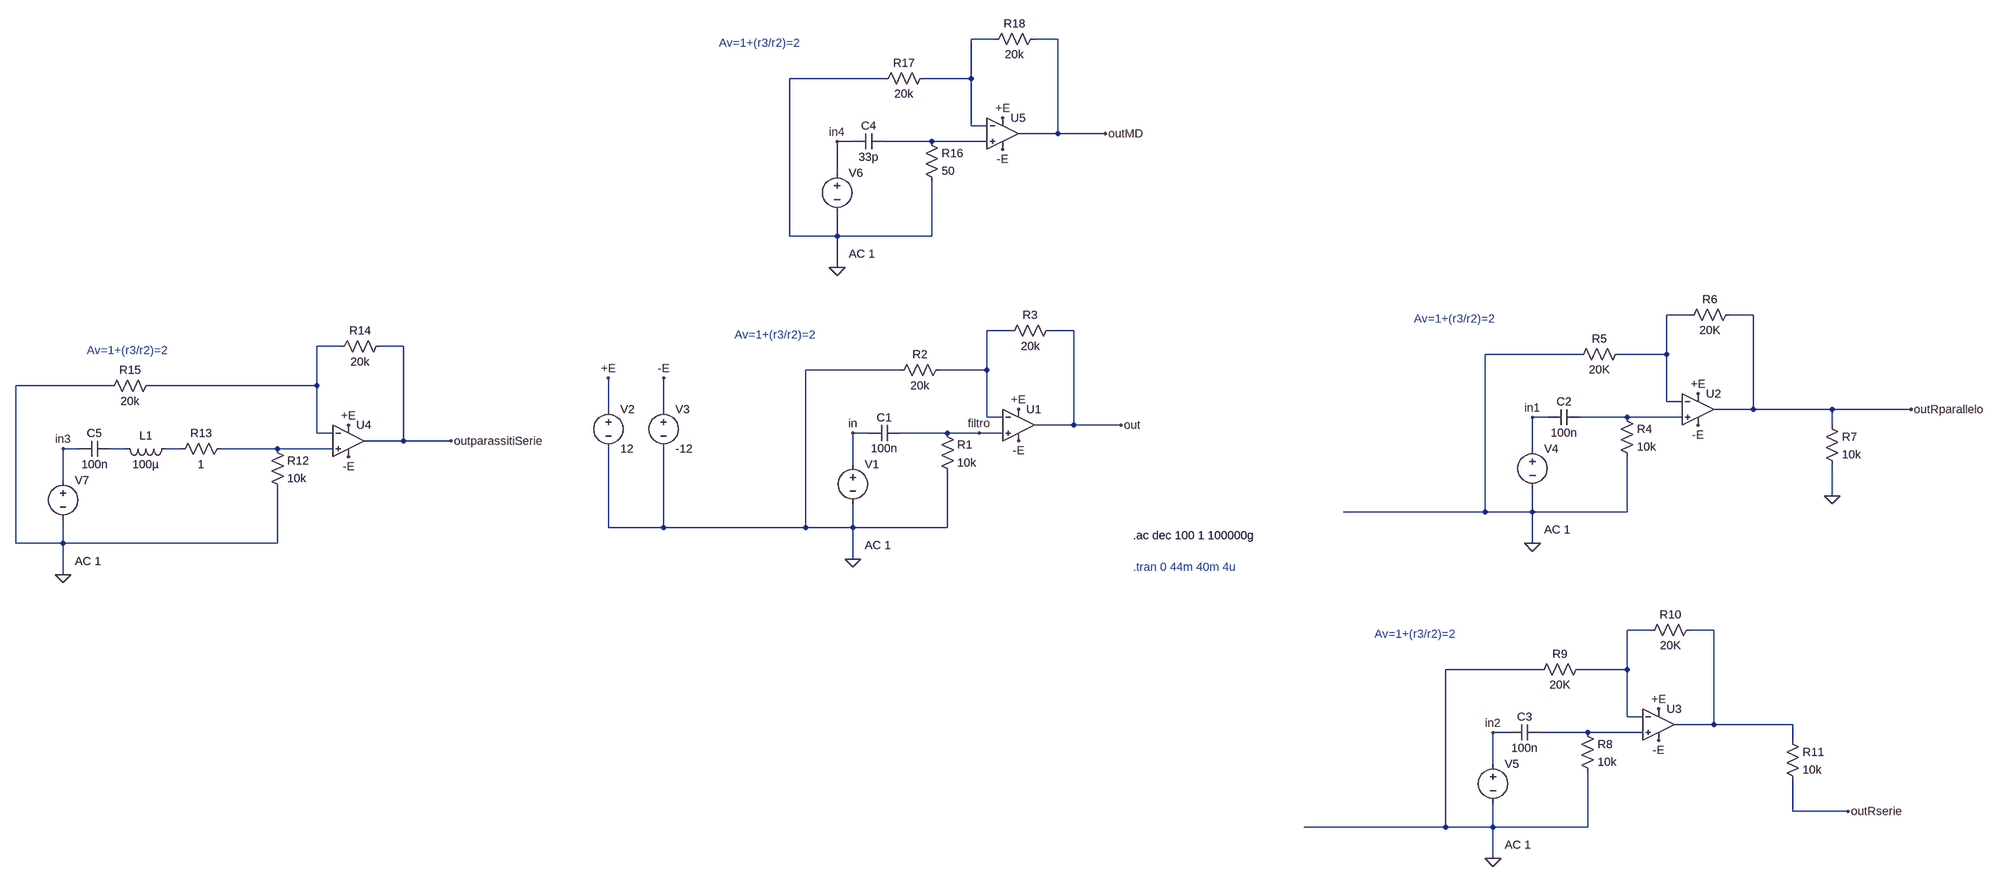
[diagram p0: schematic filto-passa-alto-rc-attivo.asc]
filto-passa-alto-rc-attivo.asc, the LTspice schematic file:
Version 4.1
SHEET 1 2316 1028
WIRE 192 -656 144 -656
WIRE 320 -656 272 -656
WIRE -32 -576 -224 -576
WIRE 144 -576 144 -656
WIRE 144 -576 48 -576
WIRE 144 -480 144 -576
WIRE 176 -480 144 -480
WIRE 320 -464 320 -656
WIRE 320 -464 240 -464
WIRE 416 -464 320 -464
WIRE -96 -448 -128 -448
WIRE 64 -448 -32 -448
WIRE 176 -448 64 -448
WIRE -128 -384 -128 -448
WIRE -224 -256 -224 -576
WIRE -128 -256 -128 -304
WIRE -128 -256 -224 -256
WIRE 64 -256 64 -368
WIRE 64 -256 -128 -256
WIRE -128 -192 -128 -256
WIRE 1696 -96 1648 -96
WIRE 1824 -96 1776 -96
WIRE 224 -64 176 -64
WIRE 352 -64 304 -64
WIRE -1312 -32 -1360 -32
WIRE -1184 -32 -1232 -32
WIRE 1472 -16 1280 -16
WIRE 1648 -16 1648 -96
WIRE 1648 -16 1552 -16
WIRE 0 16 -192 16
WIRE 176 16 176 -64
WIRE 176 16 80 16
WIRE -1824 48 -2016 48
WIRE -1360 48 -1360 -32
WIRE -1360 48 -1744 48
WIRE 1648 80 1648 -16
WIRE 1680 80 1648 80
WIRE -592 96 -592 32
WIRE -480 96 -480 32
WIRE 1824 96 1824 -96
WIRE 1824 96 1744 96
WIRE 1984 96 1824 96
WIRE 2144 96 1984 96
WIRE 176 112 176 16
WIRE 208 112 176 112
WIRE 1408 112 1376 112
WIRE 1568 112 1472 112
WIRE 1680 112 1568 112
WIRE 352 128 352 -64
WIRE 352 128 272 128
WIRE 448 128 352 128
WIRE 1984 128 1984 96
WIRE -1360 144 -1360 48
WIRE -1328 144 -1360 144
WIRE -64 144 -96 144
WIRE 96 144 0 144
WIRE 160 144 96 144
WIRE 208 144 160 144
WIRE -1184 160 -1184 -32
WIRE -1184 160 -1264 160
WIRE -1088 160 -1184 160
WIRE -1888 176 -1920 176
WIRE -1792 176 -1824 176
WIRE -1680 176 -1712 176
WIRE -1440 176 -1600 176
WIRE -1328 176 -1440 176
WIRE 1376 176 1376 112
WIRE -96 208 -96 144
WIRE -1920 240 -1920 176
WIRE 1984 272 1984 208
WIRE 1280 304 1280 -16
WIRE 1280 304 992 304
WIRE 1376 304 1376 256
WIRE 1376 304 1280 304
WIRE 1568 304 1568 192
WIRE 1568 304 1376 304
WIRE -592 336 -592 176
WIRE -480 336 -480 176
WIRE -480 336 -592 336
WIRE -192 336 -192 16
WIRE -192 336 -480 336
WIRE -96 336 -96 288
WIRE -96 336 -192 336
WIRE 96 336 96 224
WIRE 96 336 -96 336
WIRE -2016 368 -2016 48
WIRE -1920 368 -1920 320
WIRE -1920 368 -2016 368
WIRE -1440 368 -1440 256
WIRE -1440 368 -1920 368
WIRE 1376 368 1376 304
WIRE -96 400 -96 336
WIRE -1920 432 -1920 368
WIRE 1616 544 1568 544
WIRE 1744 544 1696 544
WIRE 1392 624 1200 624
WIRE 1568 624 1568 544
WIRE 1568 624 1472 624
WIRE 1568 720 1568 624
WIRE 1600 720 1568 720
WIRE 1744 736 1744 544
WIRE 1744 736 1664 736
WIRE 1904 736 1744 736
WIRE 1328 752 1296 752
WIRE 1488 752 1392 752
WIRE 1600 752 1488 752
WIRE 1904 768 1904 736
WIRE 1296 816 1296 752
WIRE 1904 912 1904 848
WIRE 2016 912 1904 912
WIRE 1200 944 1200 624
WIRE 1200 944 912 944
WIRE 1296 944 1296 896
WIRE 1296 944 1200 944
WIRE 1488 944 1488 832
WIRE 1488 944 1296 944
WIRE 1296 1008 1296 944
FLAG -96 400 0
FLAG 448 128 out
FLAG -96 144 in
FLAG -592 32 +E
FLAG -480 32 -E
FLAG 240 160 -E
FLAG 240 96 +E
FLAG 1376 368 0
FLAG 1376 112 in1
FLAG 1712 128 -E
FLAG 1712 64 +E
FLAG 1984 272 0
FLAG 2144 96 outRparallelo
FLAG 1296 1008 0
FLAG 1296 752 in2
FLAG 1632 768 -E
FLAG 1632 704 +E
FLAG 2016 912 outRserie
FLAG 160 144 filtro
FLAG -1088 160 outparassitiSerie
FLAG -1296 192 -E
FLAG -1296 128 +E
FLAG -1920 432 0
FLAG -1920 176 in3
FLAG -128 -192 0
FLAG 416 -464 outMD
FLAG -128 -448 in4
FLAG 208 -432 -E
FLAG 208 -496 +E
SYMBOL cap 0 128 R90
WINDOW 0 0 32 VBottom 2
WINDOW 3 32 32 VTop 2
SYMATTR InstName C1
SYMATTR Value 100n
SYMATTR SpiceLine Rser=1 Lser=100u
SYMBOL res 80 128 R0
SYMATTR InstName R1
SYMATTR Value 10k
SYMBOL OpAmps\\UniversalOpAmp2 240 128 R0
SYMATTR InstName U1
SYMATTR Value2 Avol=1e12 GBW=1e15 Slew=1e15
SYMATTR SpiceLine Ilimit=1e9 Rail=0 Vos=0
SYMATTR SpiceLine2 En=0 Enk=0 In=0 Ink=0 Rin=1e12
SYMBOL res 96 0 R90
WINDOW 0 0 56 VBottom 2
WINDOW 3 32 56 VTop 2
SYMATTR InstName R2
SYMATTR Value 20k
SYMBOL res 320 -80 R90
WINDOW 0 0 56 VBottom 2
WINDOW 3 32 56 VTop 2
SYMATTR InstName R3
SYMATTR Value 20k
SYMBOL voltage -96 192 R0
WINDOW 3 24 44 Left 2
WINDOW 123 24 180 Left 2
WINDOW 39 0 0 Left 0
SYMATTR Value ""
SYMATTR Value2 AC 1
SYMATTR InstName V1
SYMBOL voltage -592 80 R0
WINDOW 123 0 0 Left 0
WINDOW 39 0 0 Left 0
SYMATTR InstName V2
SYMATTR Value 12
SYMBOL voltage -480 80 R0
WINDOW 123 0 0 Left 0
WINDOW 39 0 0 Left 0
SYMATTR InstName V3
SYMATTR Value -12
SYMBOL cap 1472 96 R90
WINDOW 0 0 32 VBottom 2
WINDOW 3 32 32 VTop 2
SYMATTR InstName C2
SYMATTR Value 100n
SYMBOL res 1552 96 R0
SYMATTR InstName R4
SYMATTR Value 10k
SYMBOL OpAmps\\UniversalOpAmp2 1712 96 R0
SYMATTR InstName U2
SYMBOL res 1568 -32 R90
WINDOW 0 0 56 VBottom 2
WINDOW 3 32 56 VTop 2
SYMATTR InstName R5
SYMATTR Value 20K
SYMBOL res 1792 -112 R90
WINDOW 0 0 56 VBottom 2
WINDOW 3 32 56 VTop 2
SYMATTR InstName R6
SYMATTR Value 20K
SYMBOL voltage 1376 160 R0
WINDOW 3 24 152 Left 2
WINDOW 123 24 180 Left 2
WINDOW 39 0 0 Left 0
SYMATTR Value ""
SYMATTR Value2 AC 1
SYMATTR InstName V4
SYMBOL res 1968 112 R0
SYMATTR InstName R7
SYMATTR Value 10k
SYMBOL cap 1392 736 R90
WINDOW 0 0 32 VBottom 2
WINDOW 3 32 32 VTop 2
SYMATTR InstName C3
SYMATTR Value 100n
SYMBOL res 1472 736 R0
SYMATTR InstName R8
SYMATTR Value 10k
SYMBOL OpAmps\\UniversalOpAmp2 1632 736 R0
SYMATTR InstName U3
SYMBOL res 1488 608 R90
WINDOW 0 0 56 VBottom 2
WINDOW 3 32 56 VTop 2
SYMATTR InstName R9
SYMATTR Value 20K
SYMBOL res 1712 528 R90
WINDOW 0 0 56 VBottom 2
WINDOW 3 32 56 VTop 2
SYMATTR InstName R10
SYMATTR Value 20K
SYMBOL voltage 1296 800 R0
WINDOW 3 24 152 Left 2
WINDOW 123 24 180 Left 2
WINDOW 39 0 0 Left 0
SYMATTR Value ""
SYMATTR Value2 AC 1
SYMATTR InstName V5
SYMBOL res 1888 752 R0
SYMATTR InstName R11
SYMATTR Value 10k
SYMBOL res -1456 160 R0
SYMATTR InstName R12
SYMATTR Value 10k
SYMBOL OpAmps\\UniversalOpAmp2 -1296 160 R0
SYMATTR InstName U4
SYMATTR Value2 Avol=1e12 GBW=1e15 Slew=1e15
SYMATTR SpiceLine Ilimit=1e9 Rail=0 Vos=0
SYMATTR SpiceLine2 En=0 Enk=0 In=0 Ink=0 Rin=1e12
SYMBOL res -1216 -48 R90
WINDOW 0 0 56 VBottom 2
WINDOW 3 32 56 VTop 2
SYMATTR InstName R14
SYMATTR Value 20k
SYMBOL cap -1824 160 R90
WINDOW 0 0 32 VBottom 2
WINDOW 3 32 32 VTop 2
SYMATTR InstName C5
SYMATTR Value 100n
SYMBOL res -1728 32 R90
WINDOW 0 0 56 VBottom 2
WINDOW 3 32 56 VTop 2
SYMATTR InstName R15
SYMATTR Value 20k
SYMBOL voltage -1920 224 R0
WINDOW 3 24 152 Left 2
WINDOW 123 24 180 Left 2
WINDOW 39 0 0 Left 0
SYMATTR Value ""
SYMATTR Value2 AC 1
SYMATTR InstName V7
SYMBOL ind -1696 160 R90
WINDOW 0 5 56 VBottom 2
WINDOW 3 32 56 VTop 2
SYMATTR InstName L1
SYMATTR Value 100µ
SYMATTR SpiceLine Rser=1m
SYMBOL res -1584 160 R90
WINDOW 0 0 56 VBottom 2
WINDOW 3 32 56 VTop 2
SYMATTR InstName R13
SYMATTR Value 1
SYMBOL cap -32 -464 R90
WINDOW 0 0 32 VBottom 2
WINDOW 3 32 32 VTop 2
SYMATTR InstName C4
SYMATTR Value 33p
SYMATTR SpiceLine Rser=1 Lser=100u
SYMBOL res 48 -464 R0
SYMATTR InstName R16
SYMATTR Value 50
SYMBOL OpAmps\\UniversalOpAmp2 208 -464 R0
SYMATTR InstName U5
SYMATTR Value2 Avol=1e12 GBW=1e15 Slew=1e15
SYMATTR SpiceLine Ilimit=1e9 Rail=0 Vos=0
SYMATTR SpiceLine2 En=0 Enk=0 In=0 Ink=0 Rin=1e12
SYMBOL res 64 -592 R90
WINDOW 0 0 56 VBottom 2
WINDOW 3 32 56 VTop 2
SYMATTR InstName R17
SYMATTR Value 20k
SYMBOL res 288 -672 R90
WINDOW 0 0 56 VBottom 2
WINDOW 3 32 56 VTop 2
SYMATTR InstName R18
SYMATTR Value 20k
SYMBOL voltage -128 -400 R0
WINDOW 3 24 44 Left 2
WINDOW 123 24 180 Left 2
WINDOW 39 0 0 Left 0
SYMATTR Value ""
SYMATTR Value2 AC 1
SYMATTR InstName V6
TEXT 472 352 Left 2 !.ac dec 100 1 100000g
TEXT 472 416 Left 2 ;.tran 0 44m 40m 4u
TEXT -336 -56 Left 2 ;Av=1+(r3/r2)=2
TEXT 1136 -88 Left 2 ;Av=1+(r3/r2)=2
TEXT 1056 552 Left 2 ;Av=1+(r3/r2)=2
TEXT -1872 -24 Left 2 ;Av=1+(r3/r2)=2
TEXT -368 -648 Left 2 ;Av=1+(r3/r2)=2

The netlist it stands for:
* filto-passa-alto-rc-attivo.asc
C1 filtro in 100n Rser=1 Lser=100u
R1 filtro 0 10k
X§U1 filtro N004 +E -E out level2 Avol=1e12 GBW=1e15 Slew=1e15 Ilimit=1e9 Rail=0 Vos=0 En=0 Enk=0 In=0 Ink=0 Rin=1e12  ; pins In+ In- V+ V- OUT
R2 N004 0 20k
R3 out N004 20k
V1 in 0 AC 1
V2 +E 0 12
V3 -E 0 -12
C2 N006 in1 100n
R4 N006 0 10k
X§U2 N006 N003 +E -E outRparallelo level2 Avol=1Meg GBW=10Meg Slew=10Meg Ilimit=25m Rail=0 Vos=0 En=0 Enk=0 In=0 Ink=0 Rin=500Meg  ; pins In+ In- V+ V- OUT
R5 N003 0 20K
R6 outRparallelo N003 20K
V4 in1 0 AC 1
R7 outRparallelo 0 10k
C3 N012 in2 100n
R8 N012 0 10k
X§U3 N012 N010 +E -E N011 level2 Avol=1Meg GBW=10Meg Slew=10Meg Ilimit=25m Rail=0 Vos=0 En=0 Enk=0 In=0 Ink=0 Rin=500Meg  ; pins In+ In- V+ V- OUT
R9 N010 0 20K
R10 N011 N010 20K
V5 in2 0 AC 1
R11 N011 outRserie 10k
R12 N009 0 10k
X§U4 N009 N005 +E -E outparassitiSerie level2 Avol=1e12 GBW=1e15 Slew=1e15 Ilimit=1e9 Rail=0 Vos=0 En=0 Enk=0 In=0 Ink=0 Rin=1e12  ; pins In+ In- V+ V- OUT
R14 outparassitiSerie N005 20k
C5 N007 in3 100n
R15 N005 0 20k
V7 in3 0 AC 1
L1 N008 N007 100µ Rser=1m
R13 N009 N008 1
C4 N002 in4 33p Rser=1 Lser=100u
R16 N002 0 50
X§U5 N002 N001 +E -E outMD level2 Avol=1e12 GBW=1e15 Slew=1e15 Ilimit=1e9 Rail=0 Vos=0 En=0 Enk=0 In=0 Ink=0 Rin=1e12  ; pins In+ In- V+ V- OUT
R17 N001 0 20k
R18 outMD N001 20k
V6 in4 0 AC 1
.ac dec 100 1 100000g
* .tran 0 44m 40m 4u
* Av=1+(r3/r2)=2
* Av=1+(r3/r2)=2
* Av=1+(r3/r2)=2
* Av=1+(r3/r2)=2
* Av=1+(r3/r2)=2
.lib UniversalOpAmp2.lib
.backanno
.end

* Results of the author's LTspice run, read from the files saved beside the schematic
* Operating Point, zero values left out:
*   V(+e) = 12 V
*   V(-e) = -12 V
*   I(V2) = -5.999 mA
*   I(V3) = 5.999 mA
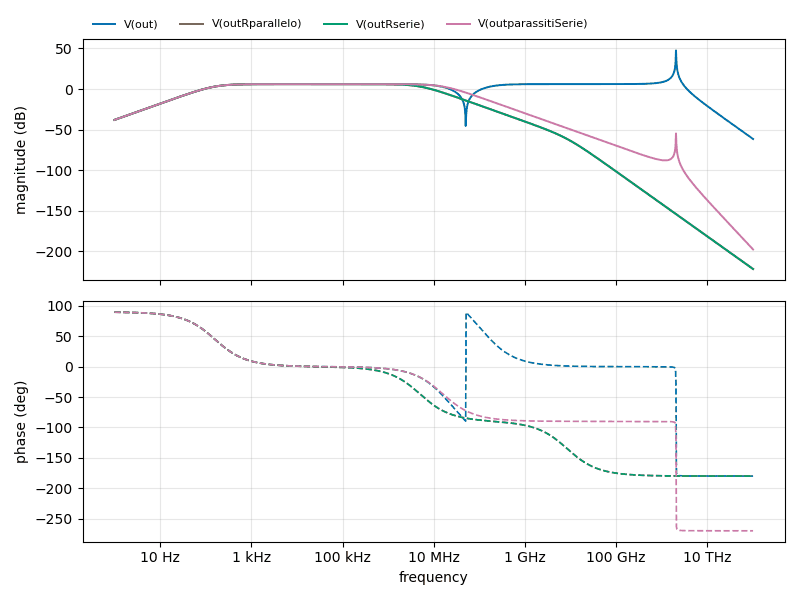
[diagram p1: AC Analysis of filto-passa-alto-rc-attivo.asc, plotted from the saved traces]
* AC Analysis, 1 run:
*   V(out): -38.02 dB at 1 Hz, -61.51 dB at 100 THz, peak 47.55 dB at 2.042 THz, 3 dB below the peak at 2.033 THz and 2.052 THz
*   V(outRparallelo): -38.02 dB at 1 Hz, -221.54 dB at 100 THz, peak 6.02 dB at 28.18 kHz, 3 dB below the peak at 159.2 Hz and 4.988 MHz
*   V(outRserie): -38.02 dB at 1 Hz, -221.54 dB at 100 THz, peak 6.02 dB at 28.18 kHz, 3 dB below the peak at 159.2 Hz and 4.992 MHz
*   V(outparassitiSerie): -38.02 dB at 1 Hz, -197.48 dB at 100 THz, peak 6.02 dB at 50.12 kHz, 3 dB below the peak at 159.1 Hz and 15.92 MHz